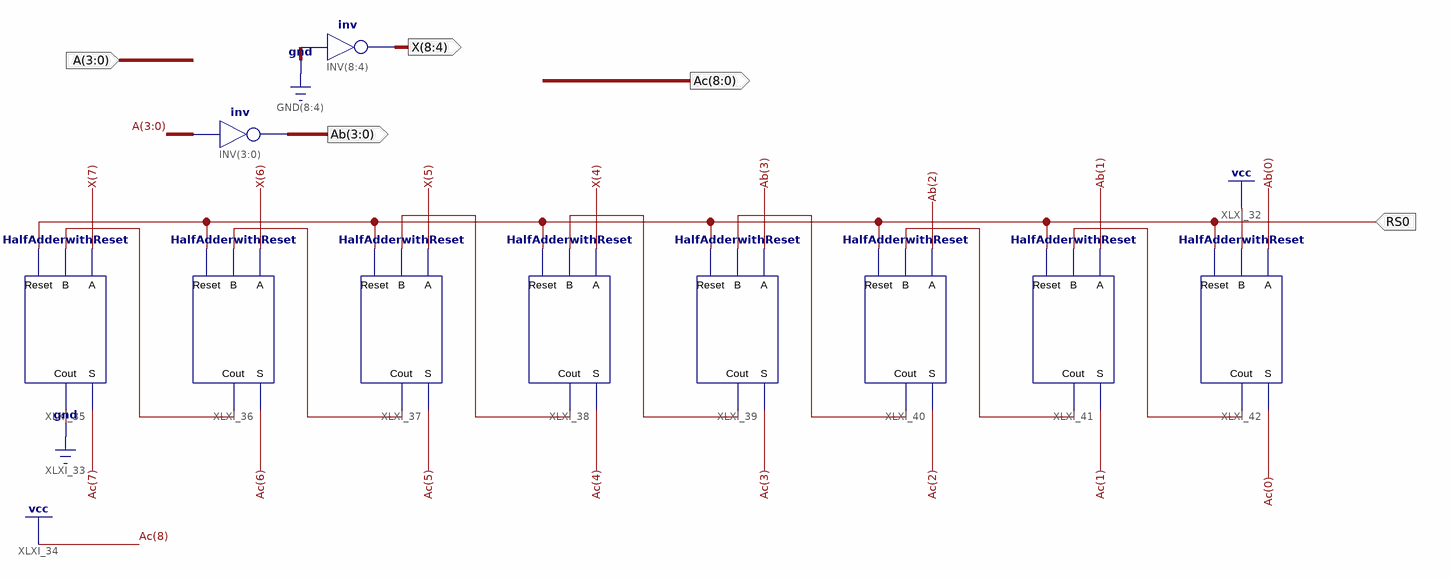
[diagram p0: schematic sheet 1]
// Xilinx ISE schematic NineBitTwosComplement.sch (artix7) as structural Verilog: 10 symbols, 5 ports
module NineBitTwosComplement (
  input  RS0,
  input  [3:0] A,
  output [3:0] Ab,
  output [8:0] Ac,
  output [8:4] X
);

  wire XLXN_65, XLXN_73, XLXN_82, XLXN_83, XLXN_84, XLXN_85, XLXN_86;

  HalfAdderwithReset XLXI_35 (.A(X[7]), .B(XLXN_86), .Cout(1'b0), .Reset(RS0), .S(Ac[7]));
  HalfAdderwithReset XLXI_36 (.A(X[6]), .B(XLXN_85), .Cout(XLXN_86), .Reset(RS0), .S(Ac[6]));
  HalfAdderwithReset XLXI_37 (.A(X[5]), .B(XLXN_84), .Cout(XLXN_85), .Reset(RS0), .S(Ac[5]));
  HalfAdderwithReset XLXI_38 (.A(X[4]), .B(XLXN_83), .Cout(XLXN_84), .Reset(RS0), .S(Ac[4]));
  HalfAdderwithReset XLXI_39 (.A(Ab[3]), .B(XLXN_82), .Cout(XLXN_83), .Reset(RS0), .S(Ac[3]));
  HalfAdderwithReset XLXI_40 (.A(Ab[2]), .B(XLXN_73), .Cout(XLXN_82), .Reset(RS0), .S(Ac[2]));
  HalfAdderwithReset XLXI_41 (.A(Ab[1]), .B(XLXN_65), .Cout(XLXN_73), .Reset(RS0), .S(Ac[1]));
  HalfAdderwithReset XLXI_42 (.A(Ab[0]), .B(1'b1), .Cout(XLXN_65), .Reset(RS0), .S(Ac[0]));
  assign Ab = ~A;  // inv INV[3..0], 4 bits wide
  assign X = ~{5{1'b0}};  // inv INV[8..4], 5 bits wide

  assign Ac[8] = 1'b1;
endmodule
